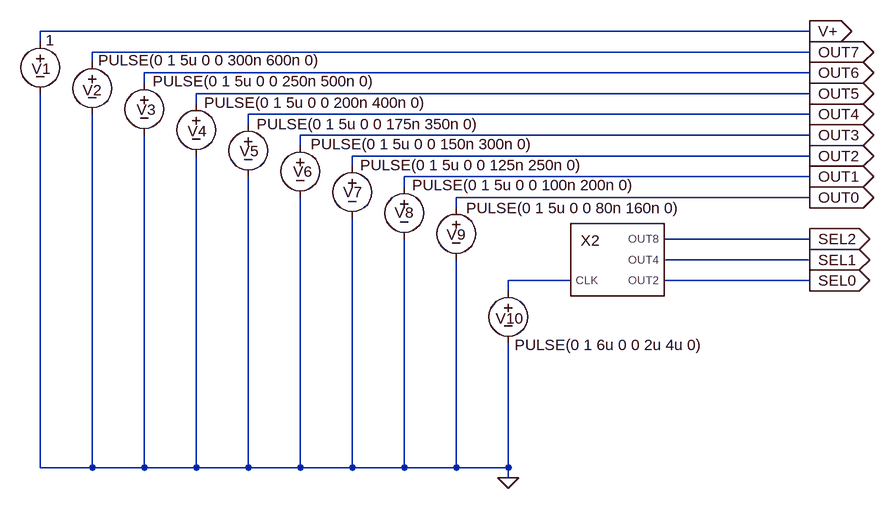
[diagram p0: schematic STIM.asc]
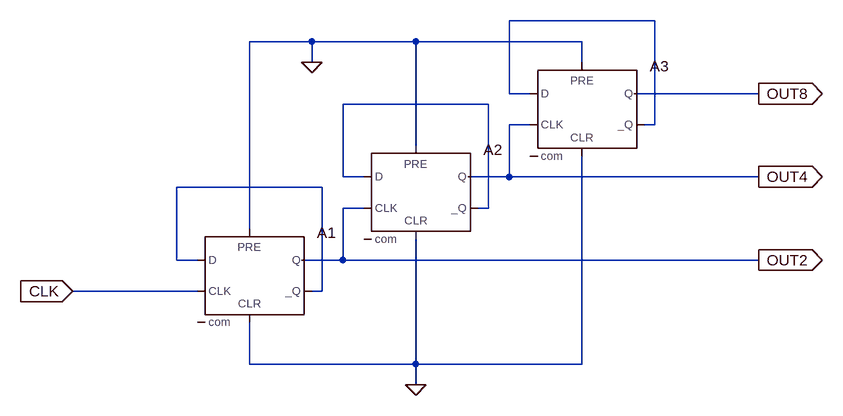
[diagram p1: sub-circuit div.asc]
STIM.asc, the LTspice schematic file:
Version 4
SHEET 1 1544 784
WIRE 1040 80 -144 80
WIRE -144 96 -144 80
WIRE 1040 112 -64 112
WIRE -64 128 -64 112
WIRE 1040 144 16 144
WIRE 16 160 16 144
WIRE 1040 176 96 176
WIRE 96 192 96 176
WIRE 1040 208 176 208
WIRE 176 224 176 208
WIRE 1040 240 256 240
WIRE 256 256 256 240
WIRE 1040 272 336 272
WIRE 336 288 336 272
WIRE 1040 304 416 304
WIRE 416 320 416 304
WIRE 1040 336 496 336
WIRE 496 352 496 336
WIRE 1040 400 816 400
WIRE 1040 432 816 432
WIRE 672 464 576 464
WIRE 1040 464 816 464
WIRE 576 480 576 464
WIRE -144 752 -144 176
WIRE -64 752 -64 208
WIRE -64 752 -144 752
WIRE 16 752 16 240
WIRE 16 752 -64 752
WIRE 96 752 96 272
WIRE 96 752 16 752
WIRE 176 752 176 304
WIRE 176 752 96 752
WIRE 256 752 256 336
WIRE 256 752 176 752
WIRE 336 752 336 368
WIRE 336 752 256 752
WIRE 416 752 416 400
WIRE 416 752 336 752
WIRE 496 752 496 432
WIRE 496 752 416 752
WIRE 576 752 576 560
WIRE 576 752 496 752
WIRE 576 768 576 752
FLAG 576 768 0
FLAG 1040 80 V+
IOPIN 1040 80 Out
FLAG 1040 112 OUT7
IOPIN 1040 112 Out
FLAG 1040 144 OUT6
IOPIN 1040 144 Out
FLAG 1040 176 OUT5
IOPIN 1040 176 Out
FLAG 1040 208 OUT4
IOPIN 1040 208 Out
FLAG 1040 240 OUT3
IOPIN 1040 240 Out
FLAG 1040 272 OUT2
IOPIN 1040 272 Out
FLAG 1040 304 OUT1
IOPIN 1040 304 Out
FLAG 1040 336 OUT0
IOPIN 1040 336 Out
FLAG 1040 400 SEL2
IOPIN 1040 400 Out
FLAG 1040 432 SEL1
IOPIN 1040 432 Out
FLAG 1040 464 SEL0
IOPIN 1040 464 Out
SYMBOL voltage -144 80 R0
WINDOW 0 -13 58 Left 2
WINDOW 3 8 14 Left 2
SYMATTR InstName V1
SYMATTR Value 1
SYMBOL voltage -64 112 R0
WINDOW 0 -15 59 Left 2
WINDOW 3 9 13 Left 2
SYMATTR InstName V2
SYMATTR Value PULSE(0 1 5u 0 0 300n 600n 0)
SYMBOL voltage 16 144 R0
WINDOW 0 -12 57 Left 2
WINDOW 3 13 13 Left 2
SYMATTR InstName V3
SYMATTR Value PULSE(0 1 5u 0 0 250n 500n 0)
SYMBOL voltage 96 176 R0
WINDOW 0 -13 58 Left 2
WINDOW 3 12 14 Left 2
SYMATTR InstName V4
SYMATTR Value PULSE(0 1 5u 0 0 200n 400n 0)
SYMBOL voltage 176 208 R0
WINDOW 0 -13 57 Left 2
WINDOW 3 13 15 Left 2
SYMATTR InstName V5
SYMATTR Value PULSE(0 1 5u 0 0 175n 350n 0)
SYMBOL voltage 256 240 R0
WINDOW 0 -11 56 Left 2
WINDOW 3 16 14 Left 2
SYMATTR InstName V6
SYMATTR Value PULSE(0 1 5u 0 0 150n 300n 0)
SYMBOL voltage 336 272 R0
WINDOW 0 -14 56 Left 2
WINDOW 3 12 14 Left 2
SYMATTR InstName V7
SYMATTR Value PULSE(0 1 5u 0 0 125n 250n 0)
SYMBOL voltage 416 304 R0
WINDOW 0 -15 55 Left 2
WINDOW 3 12 13 Left 2
SYMATTR InstName V8
SYMATTR Value PULSE(0 1 5u 0 0 100n 200n 0)
SYMBOL voltage 496 336 R0
WINDOW 0 -15 57 Left 2
WINDOW 3 15 16 Left 2
SYMATTR InstName V9
SYMATTR Value PULSE(0 1 5u 0 0 80n 160n 0)
SYMBOL voltage 576 464 R0
WINDOW 0 -19 58 Left 2
WINDOW 3 10 99 Left 2
SYMATTR InstName V10
SYMATTR Value PULSE(0 1 6u 0 0 2u 4u 0)
SYMBOL DIV 736 432 R0
WINDOW 0 -34 -14 Bottom 2
SYMATTR InstName X2

div.asc, the sub-circuit schematic file:
Version 4
SHEET 1 1116 760
WIRE 848 -128 624 -128
WIRE 320 -96 224 -96
WIRE 480 -96 320 -96
WIRE 736 -96 480 -96
WIRE 320 -64 320 -96
WIRE 736 -64 736 -96
WIRE 624 -16 624 -128
WIRE 656 -16 624 -16
WIRE 1008 -16 816 -16
WIRE 592 0 368 0
WIRE 656 32 624 32
WIRE 848 32 848 -128
WIRE 848 32 832 32
WIRE 480 64 480 -96
WIRE 368 112 368 0
WIRE 400 112 368 112
WIRE 624 112 624 32
WIRE 624 112 560 112
WIRE 1008 112 624 112
WIRE 336 128 112 128
WIRE 400 160 368 160
WIRE 592 160 592 0
WIRE 592 160 576 160
WIRE 224 192 224 -96
WIRE 112 240 112 128
WIRE 144 240 112 240
WIRE 368 240 368 160
WIRE 368 240 304 240
WIRE 1008 240 368 240
WIRE 144 288 -48 288
WIRE 336 288 336 128
WIRE 336 288 320 288
WIRE 224 400 224 336
WIRE 480 400 480 208
WIRE 480 400 224 400
WIRE 736 400 736 80
WIRE 736 400 480 400
WIRE 480 432 480 400
FLAG 480 432 0
FLAG -48 288 CLK
IOPIN -48 288 In
FLAG 1008 240 OUT2
IOPIN 1008 240 Out
FLAG 1008 112 OUT4
IOPIN 1008 112 Out
FLAG 1008 -16 OUT8
IOPIN 1008 -16 Out
FLAG 320 -64 0
SYMBOL Digital/dflop 224 192 R0
SYMATTR InstName A1
SYMBOL Digital/dflop 480 64 R0
SYMATTR InstName A2
SYMBOL Digital/dflop 736 -64 R0
SYMATTR InstName A3

The netlist it stands for:
* STIM.asc
V1 V+ 0 1
V2 OUT7 0 PULSE(0 1 5u 0 0 300n 600n 0)
V3 OUT6 0 PULSE(0 1 5u 0 0 250n 500n 0)
V4 OUT5 0 PULSE(0 1 5u 0 0 200n 400n 0)
V5 OUT4 0 PULSE(0 1 5u 0 0 175n 350n 0)
V6 OUT3 0 PULSE(0 1 5u 0 0 150n 300n 0)
V7 OUT2 0 PULSE(0 1 5u 0 0 125n 250n 0)
V8 OUT1 0 PULSE(0 1 5u 0 0 100n 200n 0)
V9 OUT0 0 PULSE(0 1 5u 0 0 80n 160n 0)
V10 N001 0 PULSE(0 1 6u 0 0 2u 4u 0)
XX2 N001 SEL0 SEL1 SEL2 div

* block symbol definitions
.subckt div CLK OUT2 OUT4 OUT8
A1 N003 0 CLK 0 0 N003 OUT2 0 DFLOP
A2 N002 0 OUT2 0 0 N002 OUT4 0 DFLOP
A3 N001 0 OUT4 0 0 N001 OUT8 0 DFLOP
.ends div

.backanno
.end